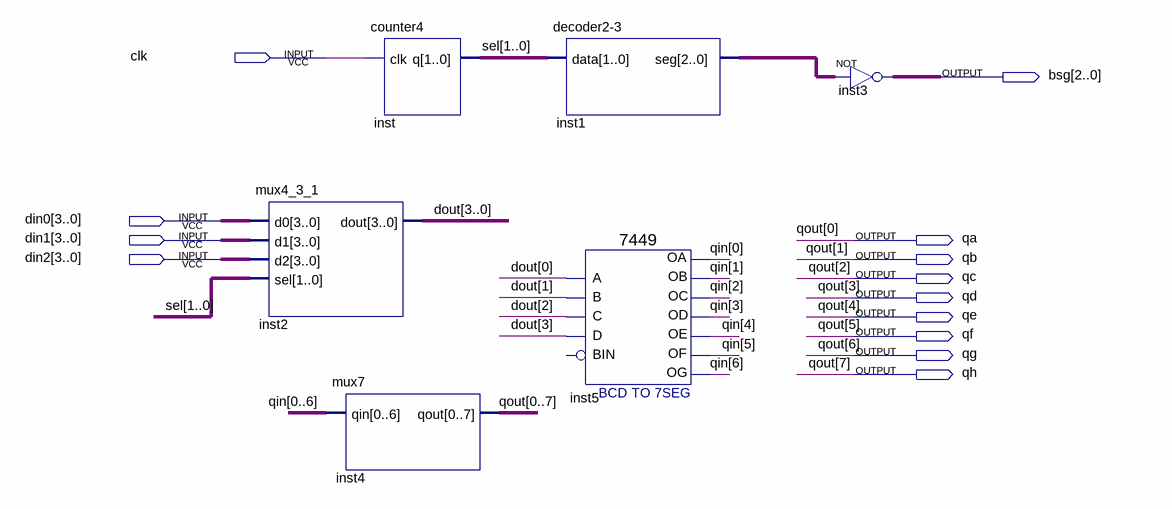
[diagram p0: schematic sheet]
// Quartus schematic scan_led3.bdf as structural Verilog: 6 symbols, 13 pins
module scan_led3 (
  input  clk,
  input  [3:0] din0,
  input  [3:0] din1,
  input  [3:0] din2,
  output [2:0] bsg,
  output qa,
  output qb,
  output qc,
  output qd,
  output qe,
  output qf,
  output qg,
  output qh
);

  wire [1:0] sel;
  wire [2:0] inst1_seg;
  wire [3:0] dout;
  wire [6:0] qin;

  mux4_3_1 inst2 (.d0(din0), .d1(din1), .d2(din2), .sel(sel), .dout(dout));
  counter4 inst (.clk(clk), .q(sel));
  mux7 inst4 (.qin({qin[0], qin[1], qin[2], qin[3], qin[4], qin[5], qin[6]}), .qout({qa, qb, qc, qd, qe, qf, qg, qh}));
  \decoder2-3  inst1 (.data(sel), .seg(inst1_seg));
  \7449  inst5 (
    .A(dout[0]), .C(dout[2]), .B(dout[1]), .D(dout[3]), .OC(qin[2]), .OD(qin[3]), .OF(qin[5]), .OG(qin[6]),
    .OB(qin[1]), .OA(qin[0]), .OE(qin[4]));  // open: BIN
  assign bsg = ~inst1_seg;  // NOT inst3, 3 bits wide

  // Other names for the same wires on the sheet: qout[7:0] = {qh, qg, qf, qe, qd, qc, qb, qa}
endmodule
